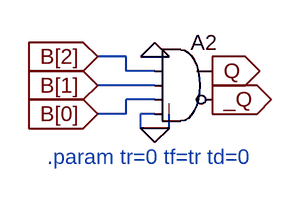
[diagram p0: schematic 3bit_and.asc]
3bit_and.asc, the LTspice schematic file:
Version 4
SHEET 1 880 680
WIRE 64 192 32 192
WIRE 64 208 64 192
WIRE 96 208 64 208
WIRE 96 224 32 224
WIRE 96 240 64 240
WIRE 64 256 64 240
WIRE 64 256 32 256
WIRE 96 256 80 256
WIRE 80 272 80 256
WIRE 96 272 80 272
WIRE 112 272 112 256
WIRE 112 272 96 272
FLAG 160 208 Q
IOPIN 160 208 Out
FLAG 160 240 _Q
IOPIN 160 240 Out
FLAG 96 272 0
FLAG 32 192 B[2]
IOPIN 32 192 In
FLAG 32 224 B[1]
IOPIN 32 224 In
FLAG 32 256 B[0]
IOPIN 32 256 In
FLAG 96 192 0
SYMBOL Digital\\and 128 160 R0
SYMATTR InstName A2
TEXT -24 304 Left 2 ;.param tr=0 tf=tr td=0

The netlist it stands for:
* 3bit_and.asc
A2 0 B[2] B[1] B[0] 0 _Q Q 0 AND
* .param tr=0 tf=tr td=0
.backanno
.end